# EAGLE schematic Servo_decoup (EAGLE 7.5.0)
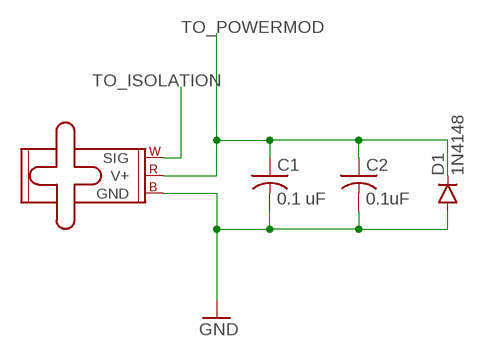
[diagram p0: schematic, sheet 1]

## Parts
C1  0.1 uF  C-US025-025X050  [C025-025X050]
C2  0.1uF  C-US025-025X050  [C025-025X050]
D1  1N4148  DIODE1N4148  [DIODE-1N4148]
M1  SMALL_SERVO  [1X03]

## Nets
GND: C1.2 C2.2 D1.A M1.3(GND)
TO_ISOLATION: M1.1(SIG)
TO_POWERMOD: C1.1 C2.1 D1.C M1.2(V+)

## Library data of the parts
C1 C2 = adafruit:C-US: CAPACITOR, American symbol
D1 = SparkFun-DiscreteSemi:DIODE: Diode These are standard reverse protection diodes and small signal diodes. SMA package can handle up to about 1A. SOD-323 can handle about 200mA. What the SOD-323 package when ordering, there are some mfgs out there that are 5-pin packages.; PROD_ID: DIO-08378
M1 = SparkFun-Electromechanical:SMALL_SERVO: Small servo motor This is the small servo used in the SIK. SKU: ROB-09065